# Altium project LM-CAL-TEST.PrjPcb
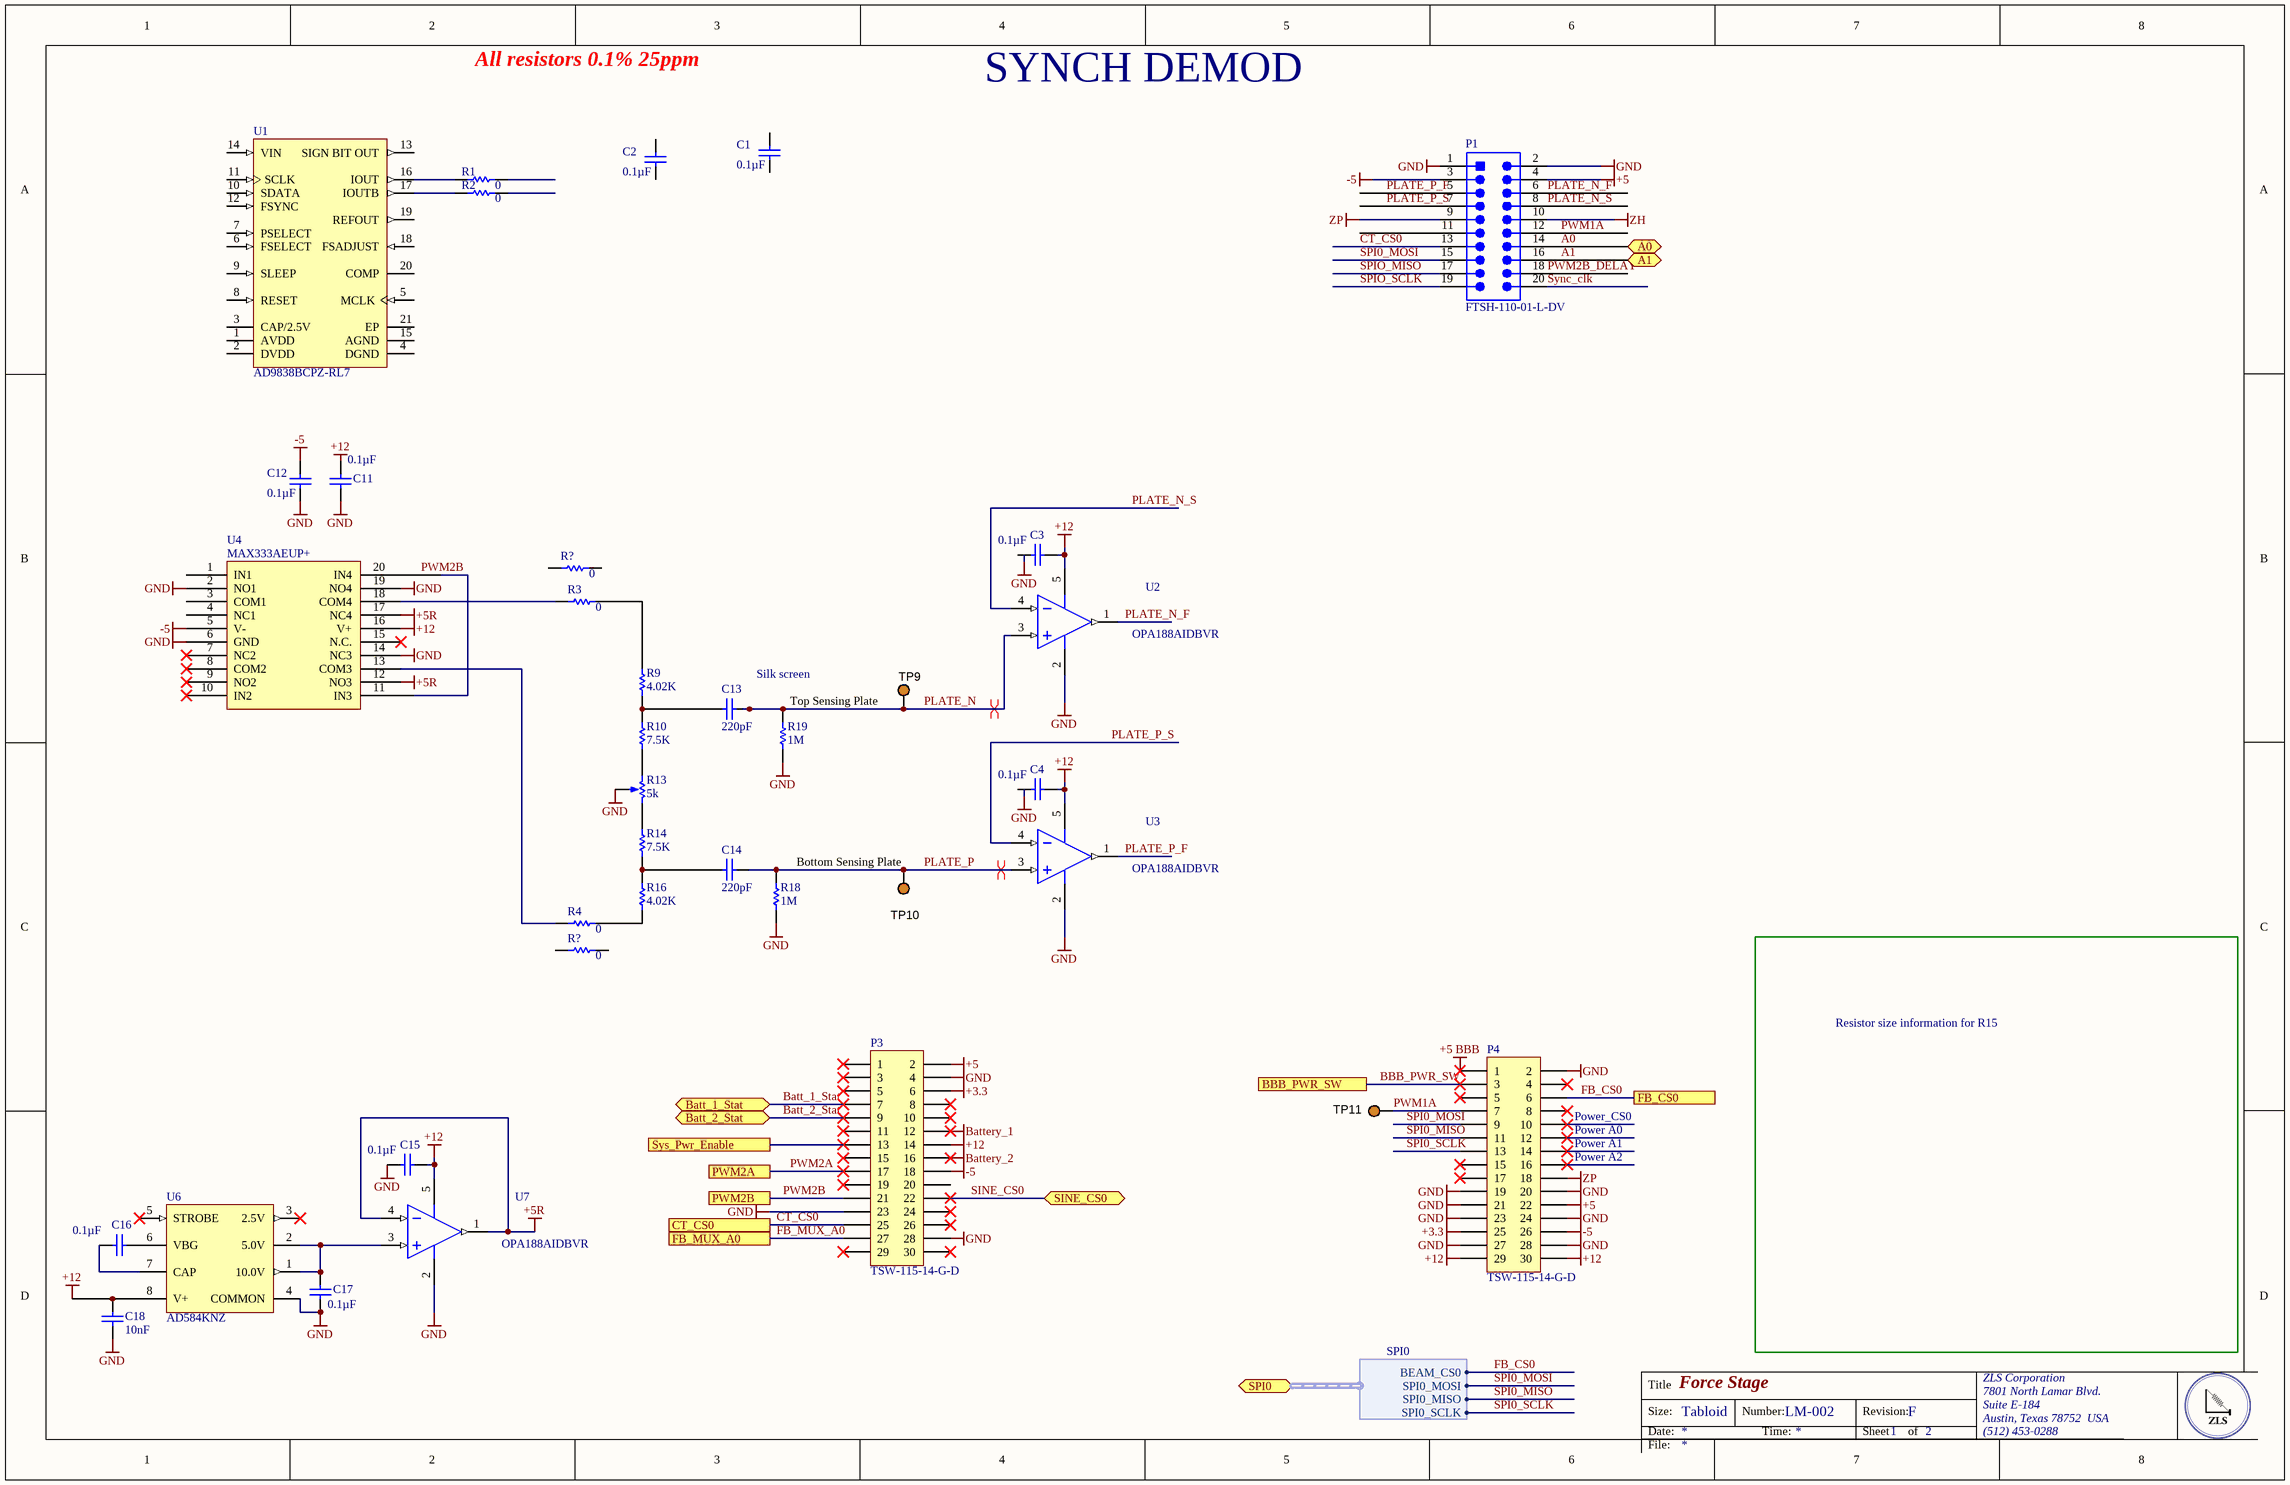
[diagram p0: synch_demod.SchDoc]
6 sheets, 79 parts. Net scope: flat (ports and power ports of the same name join across sheets).
Board file: PCB1.PcbDoc
Sheets:
  synch_demod.SchDoc
  ADC.SchDoc
  BBB.SchDoc
  Beam_Amp.SchDoc
  ZH.SchDoc
  ZP.SchDoc

## Sheet synch_demod.SchDoc: Force Stage
size Tabloid; DocumentNumber: LM-002; Revision: F; SheetNumber: 1; SheetTotal: 2; DocumentName: LM-002; ProjectName: LM-002

### Parts
(Parts that share a designator on the sheet are numbered #1, #2 ... from top to bottom, then left to right.)
C1  Capacitance: 0.1µF  [CAPC0805(2012)145_N]  (hidden comment: CAP CER 0.1UF 25V X7R 0805)
C2  Capacitance: 0.1µF  [CAPC0805(2012)145_N]  (hidden comment: CAP CER 0.1UF 25V X7R 0805)
C3  Capacitance: 0.1µF  [CAPC0805(2012)145_N]  (hidden comment: CAP CER 0.1UF 25V X7R 0805)
C4  Capacitance: 0.1µF  [CAPC0805(2012)145_N]  (hidden comment: CAP CER 0.1UF 25V X7R 0805)
C11  Capacitance: 0.1µF  [CAPC0805(2012)145_N]  (hidden comment: CAP CER 0.1UF 25V X7R 0805)
C12  Capacitance: 0.1µF  [CAPC0805(2012)145_N]  (hidden comment: CAP CER 0.1UF 25V X7R 0805)
C13  Capacitance: 220pF  [CAPC0805(2012)155_L]  (hidden comment: CAP CER 1UF 25V X7R 0805)
C14  Capacitance: 220pF  [CAPC0805(2012)155_L]  (hidden comment: CAP CER 1UF 25V X7R 0805)
C15  Capacitance: 0.1µF  [CAPC0805(2012)145_N]  (hidden comment: CAP CER 0.1UF 25V X7R 0805)
C16  Capacitance: 0.1µF  [CAPC0805(2012)145_N]  (hidden comment: CAP CER 0.1UF 25V X7R 0805)
C17  Capacitance: 0.1µF  [CAPC0805(2012)145_N]  (hidden comment: CAP CER 0.1UF 25V X7R 0805)
C18  Capacitance: 10nF  [CAPC0805(2012)145_N]  (hidden comment: Multilayer Ceramic Capacitors MLCC - SMD/SMT 0.01uF 50volts 10% X7R)
P1  FTSH-110-01-L-DV  [SMTC-FTSH-110-01-L-DV_V]
P3  TSW-115-14-G-D  [TSW-115-14-G-D]
P4  TSW-115-14-G-D  [TSW-115-14-G-D]
R1  0  [RESC0805(2012)_L]
R2  0  [RESC0805(2012)_L]
R3  0  [RESC0805(2012)_L]
R4  0  [RESC0805(2012)_L]
R9  4.02K  [RESC0805(2012)_L]
R10  7.5K  [RESC0805(2012)_L]
R13  Resistance (Ohms): 5k  [Trimmer 2.54]  (hidden comment: TRIMMER 5K OHM 0.25W PC PIN)
R14  7.5K  [RESC0805(2012)_L]
R16  4.02K  [RESC0805(2012)_L]
R18  1M  [RESC0805(2012)_L]
R19  1M  [RESC0805(2012)_L]
R?#1  0  [RESC0805(2012)_L]
R?#2  0  [RESC0805(2012)_L]
TP9  5003  [KSTN-5003]  (value not drawn)
TP10  5003  [KSTN-5003]  (value not drawn)
TP11  5003  [KSTN-5003]  (value not drawn)
U1  AD9838BCPZ-RL7  [ADI-CP-20-10_M]
U2  OPA188AIDBVR  [DBV0005A_M]
U3  OPA188AIDBVR  [DBV0005A_M]
U4  MAX333AEUP+  [TSOP65P640X90-20N]
U6  AD584KNZ  [ADI-N-8]
U7  OPA188AIDBVR  [DBV0005A_M]

### Ports
A0, A1, Batt_1_Stat, Batt_2_Stat, BBB_PWR_SW, CT_CS0, FB_CS0, FB_MUX_A0, PWM2A, PWM2B, SINE_CS0, SPI0 (harness SPI0), Sys_Pwr_Enable

### Harnesses
SPI0: BEAM_CS0, SPI0_MOSI, SPI0_MISO, SPI0_SCLK

### Nets
+3.3: P3.6 P4.25
+5: P1.4 P3.2 P4.22
+5 BBB: P4.1
+5R: U4.12(NO3) U4.17(NC4) U7.1(OUT) U7.4(IN-)
+12: C3.2 C4.2 C15.2 C18.1 P3.14 P4.29 P4.30 U2.5(V+) U3.5(V+) U4.16(V+) U6.8(V+) U7.5(V+)
-5: C12.1 P1.3 P3.18 P4.26 U4.5(V-)
Battery_1: P3.12
Battery_2: P3.16
GND: C11.2 C12.2 C15.1 C17.2 C18.2 P1.1 P1.2 P3.4 P3.23 P3.28 P4.2 P4.19 P4.20 P4.21 P4.23 P4.24 P4.27 P4.28 R13.2(b) R18.1 R19.1 U2.2(V-) U3.2(V-) U4.2(NO1) U4.6(GND) U4.14(NC3) U4.19(NO4) U6.4(COMMON) U7.2(V-)
ZH: P1.10
ZP: P1.9 P4.18
A0: P1.14 ; port A0
A1: P1.16 ; port A1
Batt_1_Stat: P3.7 ; port Batt_1_Stat
Batt_2_Stat: P3.9 ; port Batt_2_Stat
BBB_PWR_SW: P4.3 ; port BBB_PWR_SW
CT_CS0: P1.13 P3.25 ; port CT_CS0
FB_CS0: P4.6 ; port FB_CS0, port SPI0.BEAM_CS0
FB_MUX_A0: P3.27 ; port FB_MUX_A0
PLATE_N: C13.1 R19.2 TP9.1 U2.3(IN+)
PLATE_N_F: P1.6 U2.1(OUT)
PLATE_N_S: P1.8 U2.4(IN-)
PLATE_P: C14.2 R18.2 TP10.1 U3.3(IN+)
PLATE_P_F: P1.5 U3.1(OUT)
PLATE_P_S: P1.7 U3.4(IN-)
PWM1A: P1.12 P4.7 TP11.1
PWM2A: P3.17 ; port PWM2A
PWM2B: P3.21 U4.11(IN3) U4.20(IN4) ; port PWM2B
PWM2B_DELAY: P1.18
SINE_CS0: P3.22 ; port SINE_CS0
SPI0_MISO: P4.11 ; port SPI0.SPI0_MISO
SPI0_MOSI: P1.15 P4.9 ; port SPI0.SPI0_MOSI
SPI0_SCLK: P4.13 ; port SPI0.SPI0_SCLK
SPIO_MISO: P1.17
SPIO_SCLK: P1.19
Sync_clk: P1.20
NetC13_2: C13.2 R9.1 R10.2
NetC14_1: C14.1 R14.1 R16.2
NetC16_1: C16.1 U6.7(CAP)
NetC16_2: C16.2 U6.6(VBG)
NetC17_1: C17.1 U6.1(10.0V) U6.2(5.0V) U7.3(IN+)
NetP3_13: P3.13 ; port Sys_Pwr_Enable
NetR1_2: R1.2 U1.16(IOUT)
NetR2_2: R2.2 U1.17(IOUTB)
NetR3_1: R3.1 R9.2
NetR3_2: R3.2 U4.18(COM4)
NetR4_1: R4.1 R16.1
NetR4_2: R4.2 U4.13(COM3)
NetR10_1: R10.1 R13.1(a)
NetR13_3: R13.3(c) R14.2

Not connected (* = marked no-connect by the designer): C1 1 2; C2 1 2; C3 1; C4 1; C11 1; P1 11; P3 1* 3* 5* 8* 10* 11* 15* 19* 20 24* 26* 29* 30*; P4 4* 5* 8* 10* 12* 14* 15* 16* 17*; R1 1; R2 1; R?#1 1 2; R?#2 1 2; U1 1(AVDD) 2(DVDD) 3(CAP/2.5V) 4(DGND) 5(MCLK) 6(FSELECT) 7(PSELECT) 8(RESET) 9(SLEEP) 10(SDATA) 11(SCLK) 12(FSYNC) 13(SIGN_BIT_OUT) 14(VIN) 15(AGND) 18(FSADJUST) 19(REFOUT) 20(COMP) 21(EP); U4 1(IN1) 3(COM1) 4(NC1) 7(NC2)* 8(COM2)* 9(NO2)* 10(IN2)* 15(N.C.)*; U6 3(2.5V)* 5(STROBE)*

### Layout directives
differential pair: PLATE_N, PLATE_P

### Notes on the sheet
- All resistors 0.1% 25ppm
- SYNCH DEMOD
- Silk screen
- Top Sensing Plate
- (near TP10) Bottom Sensing Plate
- Resistor size information for R15
- (near P4) Power_CS0
- (near P4) Power A0
- (near P4) Power A1
- (near P4) Power A2
- Labels drawn without touching a wire or pin: +12
- Title
- Size:
- Date:
- Tabloid
- Number:
- Time:
- Revision:
- Sheet
- of
- ZLS Corporation
- 7801 North Lamar Blvd.
- Suite E-184
- Austin, Texas 78752  USA
- (512) 453-0288
- File:

### Library data of the parts
C1-C4 C11 C12 C15-C17 = CMP-1036-04795-1: Manufacturer: Murata Electronics North America; Manufacturer Part Number: GRM21BR71E104KA01L; Tolerance: ±10%; Supplier 1: Digi-Key; Supplier Part Number 1: 490-1673-6-ND; RoHS: RoHS Compliant; Category: Capacitors; Stock 1: 891652; Pricing 1: 1=0.2, 10=0.145, 100=0.0683, 500=0.04788, 1000=0.03964 (USD); Packaging: Digi-Reel®; Part Status: Active; Voltage - Rated: 25V; Temperature Coefficient: X7R; Operating Temperature: -55°C ~ 125°C; Features: -; Ratings: -; Applications: General Purpose; Mounting Type: Surface Mount, MLCC; Package / Case: 0805 (2012 Metric); Size / Dimension: 0.079" L x 0.049" W (2.00mm x 1.25mm); Height - Seated (Max): -; Thickness (Max): 0.053" (1.35mm); Lead Spacing: -; Lead Style: -; ComponentLink1URL: http://www.murata.com/~/media/webrenewal/support/library/catalog/products/capacitor/mlcc/c02e.ashx; ComponentLink1Description: http://www.murata.com/~/media/webrenewal/support/library/catalog/products/capacitor/mlcc/c02e.ashx
C13 C14 = CMP-1036-04882-1: Manufacturer: Murata Electronics North America; Manufacturer Part Number: GRM21BR71E105KA99L; Tolerance: ±10%; Supplier 1: Digi-Key; Supplier Part Number 1: 490-6484-6-ND; RoHS: RoHS Compliant; Category: Capacitors; Stock 1: 295074; Pricing 1: 1=0.14, 10=0.099, 100=0.0468, 500=0.0328, 1000=0.02715 (USD); Packaging: Digi-Reel®; Part Status: Active; Voltage - Rated: 25V; Temperature Coefficient: X7R; Operating Temperature: -55°C ~ 125°C; Features: -; Ratings: -; Applications: General Purpose; Mounting Type: Surface Mount, MLCC; Package / Case: 0805 (2012 Metric); Size / Dimension: 0.079" L x 0.049" W (2.00mm x 1.25mm); Height - Seated (Max): -; Thickness (Max): 0.053" (1.35mm); Lead Spacing: -; Lead Style: -; ComponentLink1URL: http://www.murata.com/~/media/webrenewal/support/library/catalog/products/capacitor/mlcc/c02e.ashx; ComponentLink1Description: http://www.murata.com/~/media/webrenewal/support/library/catalog/products/capacitor/mlcc/c02e.ashx
C18 = CMP-1036-04795-1: Manufacturer: Kemet; Manufacturer Part Number: C0805C103K5RACAUTO; Voltage Rating: 50V; Supplier 1: Digi-Key; Supplier Part Number 1: 399-6924-1-ND; Stock 1: 63236; Pricing 1: 1=0.12, 10=0.087, 100=0.041, 500=0.0287, 1000=0.0238 (USD); Mount: Surface Mount; Case/Package: 0805; Case Code (Metric): 2012; Case Code (Imperial): 0805; Dielectric Material: Ceramic; Contact Plating: Tin; Min Operating Temperature: -55°C; Max Operating Temperature: 125°C; Tolerance: 10%; Packaging: Tape and Reel; Package Quantity: 1; Voltage Rating (DC): 50V; Dielectric: X7R; Termination: SMD/SMT; Length: 2mm; Height: 0.78mm; Width: 0.049inch; Thickness: 0.035inch; Depth: 1.25mm; Radiation Hardening: No; REACH SVHC: No SVHC; ComponentLink1URL: https://datasheet.ciiva.com/22700/1693454-22700519.pdf; ComponentLink1Description: https://datasheet.ciiva.com/22700/1693454-22700519.pdf; ComponentLink2URL: https://datasheet.ciiva.com/7842/1693454-7842175.pdf; ComponentLink2Description: https://datasheet.ciiva.com/7842/1693454-7842175.pdf
P1 = CMP-2000-06294-2: Male Header, Pitch 1.27 mm, 2 x 10 Position, Height 6.1 mm, -55 to 125 degC, RoHS, Tube; Manufacturer: Samtec; Online Catalog: FTSHSeries; Number of Positions Loaded: All; Connector Type: Header,Unshrouded; Product Training Modules: Board-to-BoardConnectors; Featured Product: Board-To-BoardInterconnectSystems; Other Names: SAM1161-10; EDA / CAD Models: DownloadfromAcceleratedDesigns; Number of Positions: 20; Catalog Drawings: FTSHSeriesFTSHSeriesSMTSide; Package Reference: FTSH-110-01-L-DV; Family: RectangularConnectors-Headers,MalePins; Mounting Technology: SurfaceMount; Contact Type: MalePin; Manufacturer URL: http://www.samtec.com/; Package URL: http://suddendocs.samtec.com/prints/ftsh-1xx-xx-xxx-dv-xxx-xxx-mkt.pdf; Package Description: Male Header, Pitch 1.27 mm, 2 x 10 Position, Height 6.1 mm; Packaging: Bulk; Termination: Solder; Category: Connectors,Interconnects; Fastening Type: -; Datasheet Version: F-215 , 02/2016; Contact Finish Thickness: 10µin(0.25µm); Number of Rows: 2; Datasheet URL: http://suddendocs.samtec.com/catalog_english/ftsh_smt.pdf; Mounting Type: SurfaceMount; Series: FTSH; Features: -; Contact Finish: Gold; Standard Package: 1; Color: Black
P3 P4 = Header 15X2: Header, 15-Pin, Dual row; Manufacturer: Samtec Inc.; Pitch - Mating: 0.100" (2.54mm); Number of Positions: 30; Number of Positions Loaded: All; Style: Board to Board or Cable; Shrouding: Unshrouded; Contact Length - Mating: 0.320" (8.13mm); Contact Length - Post: 0.110" (2.79mm); Overall Contact Length: 0.530" (13.46mm); Material Flammability Rating: UL94 V-0; Supplier 1: Digi-Key; Supplier Part Number 1: SAM1052-15-ND; Manufacturer Part Number: TSW-115-14-G-D; RoHS: RoHS Compliant; Category: Connectors, Interconnects; Stock 1: 0; Pricing 1: 1=3.69, 10=3.3, 100=2.7176, 500=2.1482, 1000=1.84409, 5000=1.68233, 10000=1.61763 (USD); Packaging: Bulk; Part Status: Active; Connector Type: Header; Contact Type: Male Pin; Number of Rows: 2; Row Spacing - Mating: 0.100" (2.54mm); Mounting Type: Through Hole; Termination: Solder; Fastening Type: Push-Pull; Insulation Height: 0.100" (2.54mm); Contact Shape: Square; Contact Finish - Mating: Gold; Contact Finish Thickness - Mating: 10.0µin (0.25µm); Contact Finish - Post: Gold; Contact Material: Phosphor Bronze; Insulation Material: Polybutylene Terephthalate (PBT); Features: -; Operating Temperature: -55°C ~ 125°C; Ingress Protection: -; Insulation Color: Black; Current Rating: -; Voltage Rating: -; Mated Stacking Heights: -; Contact Finish Thickness - Post: 3.00µin (0.076µm); Applications: -; ComponentLink1URL: http://suddendocs.samtec.com/prints/tsw-xxx-xx-xxx-x-xx-xxx-mkt.pdf; ComponentLink1Description: http://suddendocs.samtec.com/prints/tsw-xxx-xx-xxx-x-xx-xxx-mkt.pdf
R1-R4 R?#1 R?#2 = CMP-1013-00215-1: RES SMD 0 OHM JUMPER 1/8W 0805; Manufacturer: Panasonic Electronic Components; Manufacturer Part Number: ERJ-6GEY0R00V; Power (Watts): 0.125W, 1/8W; Supplier 1: Digi-Key; Supplier Part Number 1: P0.0ACT-ND; RoHS: RoHS Compliant; Category: Resistors; Stock 1: 3414819; Pricing 1: 1=0.1, 10=0.074, 25=0.0532, 50=0.0406, 100=0.03, 250=0.02288, 500=0.0183, 1000=0.01347 (USD); Packaging: Cut Tape (CT); Part Status: Active; Tolerance: Jumper; Composition: Thick Film; Features: Automotive AEC-Q200; Temperature Coefficient: -; Operating Temperature: -55°C ~ 155°C; Package / Case: 0805 (2012 Metric); Supplier Device Package: 0805; Size / Dimension: 0.079" L x 0.049" W (2.00mm x 1.25mm); Height - Seated (Max): 0.028" (0.70mm); Failure Rate: -; ComponentLink1URL: http://industrial.panasonic.com/www-cgi/jvcr13pz.cgi?E+PZ+3+AOA0001+ERJ6GEY0R00V+7+WW; ComponentLink1Description: http://industrial.panasonic.com/www-cgi/jvcr13pz.cgi?E+PZ+3+AOA0001+ERJ6GEY0R00V+7+WW
R9 R16 = CMP-1013-00215-1: RES SMD 4.02K OHM 1% 1/8W 0805; Manufacturer: Vishay Dale; Manufacturer Part Number: CRCW08054K02FKEAHP; Power (Watts): 0.5W, 1/2W; Temperature Coefficient: ±100ppm/°C; Supplier 1: Digi-Key; Supplier Part Number 1: 541-4.02KTCT-ND; RoHS: RoHS Compliant; Category: Resistors; Stock 1: 2935; Pricing 1: 1=0.28, 10=0.233, 100=0.0911, 1000=0.03812, 2500=0.03494 (USD); Packaging: Cut Tape (CT); Part Status: Active; Tolerance: ±1%; Composition: Thick Film; Features: Automotive AEC-Q200, Pulse Withstanding; Operating Temperature: -55°C ~ 155°C; Package / Case: 0805 (2012 Metric); Supplier Device Package: 0805; Size / Dimension: 0.079" L x 0.049" W (2.00mm x 1.25mm); Height - Seated (Max): 0.020" (0.50mm); Failure Rate: -; ComponentLink1URL: http://www.vishay.com/docs/20043/crcwhpe3.pdf; ComponentLink1Description: http://www.vishay.com/docs/20043/crcwhpe3.pdf
R10 R14 = CMP-1013-00215-1: RES SMD 7.5K OHM 1% 1/8W 0805; Manufacturer: Vishay Dale; Manufacturer Part Number: CRCW08057K50FKEA; Power (Watts): 0.125W, 1/8W; Temperature Coefficient: ±100ppm/°C; Supplier 1: Digi-Key; Supplier Part Number 1: 541-7.50KCCT-ND; RoHS: RoHS Compliant; Category: Resistors; Stock 1: 2093; Pricing 1: 1=0.1, 10=0.055, 100=0.0223, 1000=0.01003, 2500=0.0087 (USD); Packaging: Cut Tape (CT); Part Status: Active; Tolerance: ±1%; Composition: Thick Film; Features: Automotive AEC-Q200; Operating Temperature: -55°C ~ 155°C; Package / Case: 0805 (2012 Metric); Supplier Device Package: 0805; Size / Dimension: 0.079" L x 0.049" W (2.00mm x 1.25mm); Height - Seated (Max): 0.020" (0.50mm); Failure Rate: -; ComponentLink1URL: http://www.vishay.com/docs/20035/dcrcwe3.pdf; ComponentLink1Description: http://www.vishay.com/docs/20035/dcrcwe3.pdf
R13 = Trimmer: Manufacturer: Vishay Foil Resistors (Division of Vishay Precision Group); Manufacturer Part Number: Y00535K00000J0L; Power (Watts): 0.25W, 1/4W; Tolerance: ±5%; Temperature Coefficient: ±10ppm/°C; Number of Turns: 21; Adjustment Type: Side Adjustment; Resistive Material: Metal Foil; Supplier 1: Digi-Key; Supplier Part Number 1: 804-1020-ND; RoHS: RoHS Compliant; Category: Potentiometers, Variable Resistors; Stock 1: 679; Pricing 1: 1=34.42, 10=32.265, 25=26.5292, 50=22.944, 100=22.227, 250=20.793, 500=19.2156 (USD); Packaging: Bulk; Part Status: Active; Mounting Type: Through Hole; Termination Style: PC Pins; Size / Dimension: Rectangular - 0.250" x 0.175" Face x 0.250" L (6.35mm x 4.45mm x 6.35mm); ComponentLink1URL: http://www.vishaypg.com/docs/63053/1240.pdf; ComponentLink1Description: http://www.vishaypg.com/docs/63053/1240.pdf
R18 R19 = CMP-1013-00215-1: RES SMD 1M OHM 1% 1/8W 0805; Manufacturer: Vishay Dale; Manufacturer Part Number: RCV08051M00FKEA; Power (Watts): 0.125W, 1/8W; Temperature Coefficient: ±100ppm/°C; Supplier 1: Digi-Key; Supplier Part Number 1: BC2810CT-ND; RoHS: RoHS Compliant; Category: Resistors; Stock 1: 15942; Pricing 1: 1=0.31, 10=0.266, 100=0.1041, 1000=0.04356, 2500=0.03993 (USD); Packaging: Cut Tape (CT); Part Status: Active; Tolerance: ±1%; Composition: Thick Film; Features: High Voltage; Operating Temperature: -55°C ~ 155°C; Package / Case: 0805 (2012 Metric); Supplier Device Package: 0805; Size / Dimension: 0.079" L x 0.049" W (2.00mm x 1.25mm); Height - Seated (Max): 0.020" (0.50mm); Failure Rate: -; ComponentLink1URL: http://www.vishay.com/docs/20054/rcve3.pdf; ComponentLink1Description: http://www.vishay.com/docs/20054/rcve3.pdf
TP9-TP11 = CMP-1672-00009-1: Test Point, Orange, 1-Pin THD, RoHS; Peak Reverse Current: 600 uA; Forward Current: 3 A; Max Surge Current: 80 A; Forward Voltage: 1.08 V; Max Operating Temperature: 150 degC; PackageReference: 5003; Pins: 2; ComponentLink2URL: http://keyelco.com/userAssets/file/M65p56.pdf; PackageDescription: 1-Pin Through Hole Device, Dia 2.54 mm; Weight: 0.01 lb; Diameter: 5.3 mm; Mount: Through Hole; Package Quantity: 500; Packaging: Bulk; Min Operating Temperature: -65 degC; ComponentLink1Description: Manufacturer URL; Height: 0.25 inch; ComponentLink1URL: http://www.keyelco.com/; ComponentLink2Description: Datasheet; Width: 0.25 inch; REACH SVHC: No SVHC; RoHSCompliant: true; Radiation Hardening: No; Length: 9.5 mm; DatasheetVersion: Jun-15
U1 = CMP-0293-00002-1: 11 mW Power, 2.3 V to 5.5 V,Complete DDS, CP-20-10, 1500 Reel, Pb-Free; Tuning Word Width (bits): 28bit; REFCLK Multiplier: Yes; Master fclk: 16MHz; FS Iout (mA nom): 3mA; I/O Interface: Serial; Resolution (Bits): 10bit; Compliance Range (V): 800mV; ComponentLink1Description: Manufacturer URL; ComponentLink2Description: Datasheet; ComponentLink3URL: http://www.analog.com/static/imported-files/packages/PKG_PDF/LFCSP(CP)/CP_20_10.pdf; PackageVersion: 061609-B; PackageDescription: 20-Lead Lead Frame Chip Scale Package [LFCSP_WQ]; Code_JEDEC: MO-220-WGGD; ComponentLink3Description: Package Specification; DatasheetVersion: Rev. A; PackageReference: CP-20-10; ComponentLink2URL: http://www.analog.com/static/imported-files/data_sheets/AD9838.pdf; ComponentLink1URL: www.analog.com
U2 U3 U7 = CMP-0809-00005-2: Precision, Low Noise, Rail-to-Rail Output, Zero-Drift Operational Amplifier, 4 to 36 V, -40 to 125 degC, 5-pin SOT23 (DBV5), Green (RoHS & no Sb/Br); Manufacturer: Texas Instruments; Total Supply Voltage(Min)(+5V is 5, +/-5V is 10): 4; Offset Drift(Typ)(uV/C): 0.03; Rating: Catalog; SubFamily: Zero Drift Precision Amplifier; GBW(Typ)(MHz): 2; Slew Rate(Typ)(V/us): 0.8; Number of Channels: 1; CMRR(Min)(dB): 120; Iq per channel(Max)(mA): 0.51; Total Supply Voltage(Max)(+5V is 5, +/-5V is 10): 36; PartNumber: OPA188AIDBVR; ComponentLink2Description: Datasheet; ComponentLink2URL: http://www.ti.com/lit/ds/symlink/opa188.pdf; ComponentLink1Description: Manufacturer URL; Mounting Technology: Surface Mount; Eco-Plan: Green (RoHS & no Sb/Br); ComponentLink1URL: http://www.ti.com/; PackageVersion: 4073253-4/K, 03/2006; DatasheetVersion: SBOS642A; ComponentLink3Description: Package Specification; PackageReference: DBV0005A; ComponentLink3URL: http://www.ti.com/litv/pdf/mpds018i; PackageDescription: 5-Pin Plastic Small Outline, Body 1.6 x 2.9 mm, Pitch 0.95 mm; Code_JEDEC: MO-178
U4 = MAX333CWP+: IC SWITCH QUAD SPDT 20TSSOP; Manufacturer: Maxim Integrated; Multiplexer/Demultiplexer Circuit: 2:1; On-State Resistance (Max): 45 Ohm; Channel-to-Channel Matching (&Delta;Ron): 2 Ohm (Max); Voltage - Supply, Single (V+): 10 V ~ 30 V; Voltage - Supply, Dual (V±): ±4.5 V ~ 20 V; Switch Time (Ton, Toff) (Max): 175ns, 145ns; Charge Injection: 2pC; Channel Capacitance (CS(off), CD(off)): 5pF; Current - Leakage (IS(off)) (Max): 250pA; Crosstalk: -78dB @ 1MHz; Supplier 1: Digi-Key; Supplier Part Number 1: MAX333AEUP+-ND; Manufacturer Part Number: MAX333AEUP+; RoHS: RoHS Compliant; Category: Integrated Circuits (ICs); Stock 1: 1328; Pricing 1: 1=6.77, 10=6.432, 25=6, 50=5.8942 (USD); Packaging: Tube; Part Status: Active; Switch Circuit: SPDT; -3db Bandwidth: -; Operating Temperature: -40°C ~ 85°C (TA); Package / Case: 20-TSSOP (0.173", 4.40mm Width); Supplier Device Package: 20-TSSOP; Base Part Number: MAX333; ComponentLink1URL: https://pdfserv.maximintegrated.com/en/ds/MAX333A.pdf; ComponentLink1Description: https://pdfserv.maximintegrated.com/en/ds/MAX333A.pdf
U6 = CMP-0784-00054-1: Pin Programmable, Precision Voltage Reference, + 2.5 / + 5 / + 7.5 / + 10 Prog V Output, 4.5 to 30 V Supply, Commercial, 8-pin DIP (N-8), Tube; Manufacturer: Analog Devices; Max V Supply (V): 30; Min V Supply (V): 4.5; Ref Out TC (ppm/C): 15; Vout: 2.5V, 5V, 7.5V, 10V; ComponentLink3URL: http:/www.analog.com/static/imported-files/packages/PKG_PDF/PDIP(N)/N_8.pdf; ComponentLink1URL: http://www.analog.com/en/index.html; PartNumber: AD584KNZ; ComponentLink1Description: Manufacturer URL; ComponentLink2Description: Datasheet; PackageDescription: 8-Pin Plastic Dual In-Line Package, Row spacing 7.62 mm, Pitch 2.54 mm; Operating Temp Range: 0 to 70 degC; DatasheetVersion: Rev. C; Code_JEDEC: MS-001; Packing: Tube; ComponentLink3Description: Package Specification; PackageReference: N-8; ComponentLink4Description: URL Link1; Mounting Technology: Through Hole; PackageVersion: 070606-A, 07/2006; ComponentLink4URL: Product URL:http://www.analog.com/en/special-linear-functions/voltage-references/ad584/products/product.html; ComponentLink2URL: http://www.analog.com/static/imported-files/data_sheets/AD584.pdf

## Sheet ADC.SchDoc: Sense Stage
size Tabloid; DocumentNumber: LM-002; Revision: F; SheetNumber: 2; SheetTotal: 2; DocumentName: LM-002
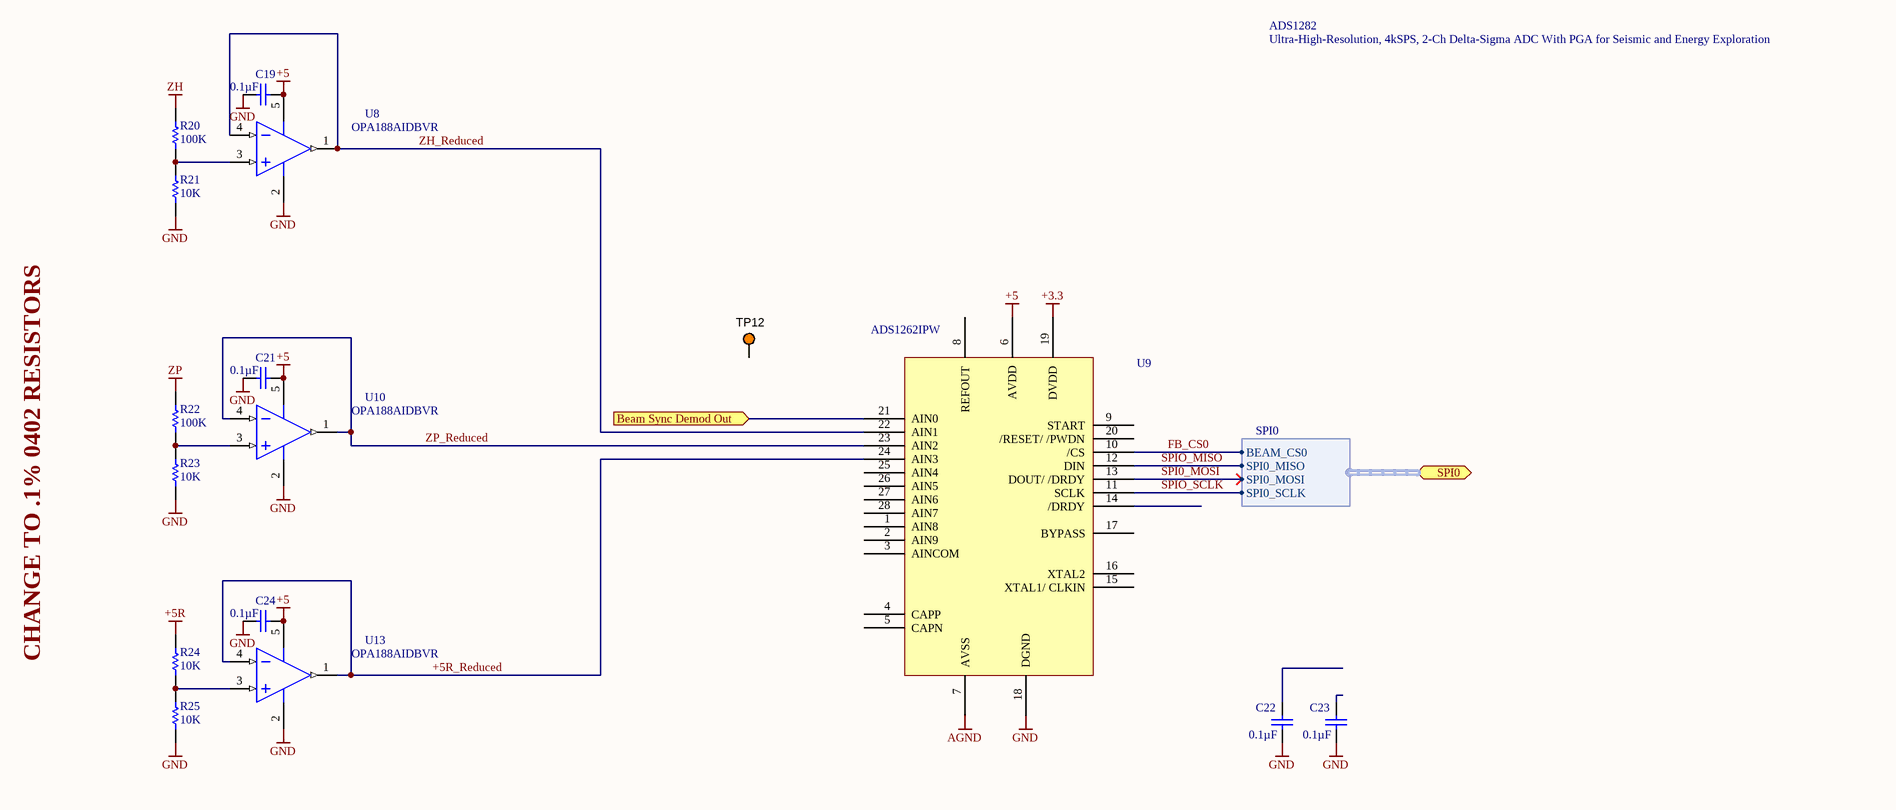
[diagram p1: ADC.SchDoc]

### Parts
C19  Capacitance: 0.1µF  [CAPC0805(2012)145_N]  (hidden comment: CAP CER 0.1UF 25V X7R 0805)
C21  Capacitance: 0.1µF  [CAPC0805(2012)145_N]  (hidden comment: CAP CER 0.1UF 25V X7R 0805)
C22  Capacitance: 0.1µF  [CAPC0805(2012)145_N]  (hidden comment: CAP CER 0.1UF 25V X7R 0805)
C23  Capacitance: 0.1µF  [CAPC0805(2012)145_N]  (hidden comment: CAP CER 0.1UF 25V X7R 0805)
C24  Capacitance: 0.1µF  [CAPC0805(2012)145_N]  (hidden comment: CAP CER 0.1UF 25V X7R 0805)
R20  100K  [RESC0805(2012)_L]
R21  10K  [RESC0805(2012)_L]
R22  100K  [RESC0805(2012)_L]
R23  10K  [RESC0805(2012)_L]
R24  10K  [RESC0805(2012)_L]
R25  10K  [RESC0805(2012)_L]
TP12  5003  [KSTN-5003]  (value not drawn)
U8  OPA188AIDBVR  [DBV0005A_M]
U9  Supplier Part Number 1: ADS1262IPW  [ADS1262]  (hidden comment: ADS1262)
U10  OPA188AIDBVR  [DBV0005A_M]
U13  OPA188AIDBVR  [DBV0005A_M]

### Ports
Beam Sync Demod Out (in), SPI0 (harness SPI0)

### Harnesses
SPI0: BEAM_CS0, SPI0_MOSI, SPI0_MISO, SPI0_SCLK

### Nets
+3.3: U9.19(DVDD)
+5: C19.2 C21.2 C24.2 U8.5(V+) U9.6(AVDD) U10.5(V+) U13.5(V+)
+5R: R24.2
AGND: U9.7(AVSS)
GND: C19.1 C21.1 C22.2 C23.2 C24.1 R21.1 R23.1 R25.1 U8.2(V-) U9.18(DGND) U10.2(V-) U13.2(V-)
ZH: R20.2
ZP: R22.2
+5R_Reduced: U9.24(AIN3) U13.1(OUT) U13.4(IN-)
FB_CS0: U9.10(/CS) ; port SPI0.BEAM_CS0
SPI0_MOSI: U9.13(DOUT/_/DRDY) ; port SPI0.SPI0_MOSI
SPIO_MISO: U9.12(DIN) ; port SPI0.SPI0_MISO  [project net SPI0_MISO]
SPIO_SCLK: U9.11(SCLK) ; port SPI0.SPI0_SCLK  [project net SPI0_SCLK]
ZH_Reduced: U8.1(OUT) U8.4(IN-) U9.22(AIN1)
ZP_Reduced: U9.23(AIN2) U10.1(OUT) U10.4(IN-)
NetR20_1: R20.1 R21.2 U8.3(IN+)
NetR22_1: R22.1 R23.2 U10.3(IN+)
NetR24_1: R24.1 R25.2 U13.3(IN+)
NetU9_21: U9.21(AIN0) ; port Beam Sync Demod Out

Not connected (* = marked no-connect by the designer): C22 1; C23 1; TP12 1; U9 1(AIN8) 2(AIN9) 3(AINCOM) 4(CAPP) 5(CAPN) 8(REFOUT) 9(START) 14(/DRDY) 15(XTAL1/_CLKIN) 16(XTAL2) 17(BYPASS) 20(/RESET/_/PWDN) 25(AIN4) 26(AIN5) 27(AIN6) 28(AIN7)

### Notes on the sheet
- ADS1282
- Ultra-High-Resolution, 4kSPS, 2-Ch Delta-Sigma ADC With PGA for Seismic and Energy Exploration
- CHANGE TO .1% 0402 RESISTORS
- Title
- Size:
- Date:
- Tabloid
- Number:
- Time:
- Revision:
- Sheet
- of
- ZLS Corporation
- 7801 North Lamar Blvd.
- Suite E-184
- Austin, Texas 78752  USA
- (512) 453-0288
- File:

### Library data of the parts
C19 C21-C24 = CMP-1036-04795-1: as C1 on sheet synch_demod; Supplier 1: Digi-Key; Supplier Part Number 1: 490-1673-6-ND; RoHS: RoHS Compliant; Category: Capacitors; Stock 1: 891652; Pricing 1: 1=0.2, 10=0.145, 100=0.0683, 500=0.04788, 1000=0.03964 (USD); Packaging: Digi-Reel®; Part Status: Active; Voltage - Rated: 25V; Temperature Coefficient: X7R; Operating Temperature: -55°C ~ 125°C; Features: -; Ratings: -; Applications: General Purpose; Mounting Type: Surface Mount, MLCC; Package / Case: 0805 (2012 Metric); Size / Dimension: 0.079" L x 0.049" W (2.00mm x 1.25mm); Height - Seated (Max): -; Thickness (Max): 0.053" (1.35mm); Lead Spacing: -; Lead Style: -; ComponentLink1URL: http://www.murata.com/~/media/webrenewal/support/library/catalog/products/capacitor/mlcc/c02e.ashx; ComponentLink1Description: http://www.murata.com/~/media/webrenewal/support/library/catalog/products/capacitor/mlcc/c02e.ashx
R20 R22 = CMP-1013-00215-1: RES SMD 100K OHM 1% 1/8W 0805; Manufacturer: Vishay Dale; Manufacturer Part Number: RCA0805100KFKEA; Power (Watts): 0.125W, 1/8W; Temperature Coefficient: ±100ppm/°C; Supplier 1: Digi-Key; Supplier Part Number 1: 541-2230-1-ND; RoHS: RoHS Compliant; Category: Resistors; Stock 1: 18704; Pricing 1: 1=0.1, 10=0.079, 100=0.0303, 1000=0.01331, 2500=0.0115 (USD); Packaging: Cut Tape (CT); Part Status: Active; Tolerance: ±1%; Composition: Thick Film; Features: Anti-Sulfur, Automotive AEC-Q200; Operating Temperature: -55°C ~ 155°C; Package / Case: 0805 (2012 Metric); Supplier Device Package: 0805; Size / Dimension: 0.079" L x 0.049" W (2.01mm x 1.25mm); Height - Seated (Max): 0.020" (0.50mm); Failure Rate: -; ComponentLink1URL: http://www.vishay.com/docs/20037/rcae3.pdf; ComponentLink1Description: http://www.vishay.com/docs/20037/rcae3.pdf
R21 R23-R25 = CMP-1013-00215-1: RES SMD 10K OHM 1% 1/8W 0805; Manufacturer: Vishay Dale; Manufacturer Part Number: CRCW080510K0FKEA; Power (Watts): 0.125W, 1/8W; Temperature Coefficient: ±100ppm/°C; Supplier 1: Digi-Key; Supplier Part Number 1: 541-10.0KCCT-ND; RoHS: RoHS Compliant; Category: Resistors; Stock 1: 1104982; Pricing 1: 1=0.1, 10=0.055, 100=0.0223, 1000=0.01003, 2500=0.0087 (USD); Packaging: Cut Tape (CT); Part Status: Active; Tolerance: ±1%; Composition: Thick Film; Features: Automotive AEC-Q200; Operating Temperature: -55°C ~ 155°C; Package / Case: 0805 (2012 Metric); Supplier Device Package: 0805; Size / Dimension: 0.079" L x 0.049" W (2.00mm x 1.25mm); Height - Seated (Max): 0.020" (0.50mm); Failure Rate: -; ComponentLink1URL: http://www.vishay.com/docs/20035/dcrcwe3.pdf; ComponentLink1Description: http://www.vishay.com/docs/20035/dcrcwe3.pdf
TP12 = CMP-1672-00009-1: as TP9 on sheet synch_demod; Max Operating Temperature: 150 degC; PackageReference: 5003; Pins: 2; ComponentLink2URL: http://keyelco.com/userAssets/file/M65p56.pdf; PackageDescription: 1-Pin Through Hole Device, Dia 2.54 mm; Weight: 0.01 lb; Diameter: 5.3 mm; Mount: Through Hole; Package Quantity: 500; Packaging: Bulk; Min Operating Temperature: -65 degC; ComponentLink1Description: Manufacturer URL; Height: 0.25 inch; ComponentLink1URL: http://www.keyelco.com/; ComponentLink2Description: Datasheet; Width: 0.25 inch; REACH SVHC: No SVHC; RoHSCompliant: true; Radiation Hardening: No; Length: 9.5 mm; DatasheetVersion: Jun-15
U8 U10 U13 = CMP-0809-00005-2: as U2 on sheet synch_demod; PartNumber: OPA188AIDBVR; ComponentLink2Description: Datasheet; ComponentLink2URL: http://www.ti.com/lit/ds/symlink/opa188.pdf; ComponentLink1Description: Manufacturer URL; Mounting Technology: Surface Mount; Eco-Plan: Green (RoHS & no Sb/Br); ComponentLink1URL: http://www.ti.com/; PackageVersion: 4073253-4/K, 03/2006; DatasheetVersion: SBOS642A; ComponentLink3Description: Package Specification; PackageReference: DBV0005A; ComponentLink3URL: http://www.ti.com/litv/pdf/mpds018i; PackageDescription: 5-Pin Plastic Small Outline, Body 1.6 x 2.9 mm, Pitch 0.95 mm; Code_JEDEC: MO-178
U9 = ADS1262: 32 bit Analog to Digital Converter; Manufacturer: Texas Instruments; Sampling Rate: 38400S/s; Interface: SPI; Number of A/D Converters: 1; Resolution: 32b; Number of Bits: 32; Min Supply Voltage: 4.75V; Max Supply Voltage: 5.25V; Power Consumption: 27mW; Supply Type: Single; Polarity: Bipolar,Unipolar; Operating Supply Voltage: 5V; Number of Inputs: 10; Supplier 1: Arrow; Manufacturer Part Number: ADS1262IPW; Stock 1: 86; Pricing 1: 1=18.662, 10=17.123, 100=14.538, 500=12.925 (USD); Mount: Surface Mount; Case/Package: TSSOP; Number of Pins: 28; Contact Plating: Gold; Min Operating Temperature: -40°C; Max Operating Temperature: 125°C; Packaging: Rail/Tube; REACH SVHC: No SVHC; Lead Free: Lead Free

## Sheet BBB.SchDoc
size Tabloid
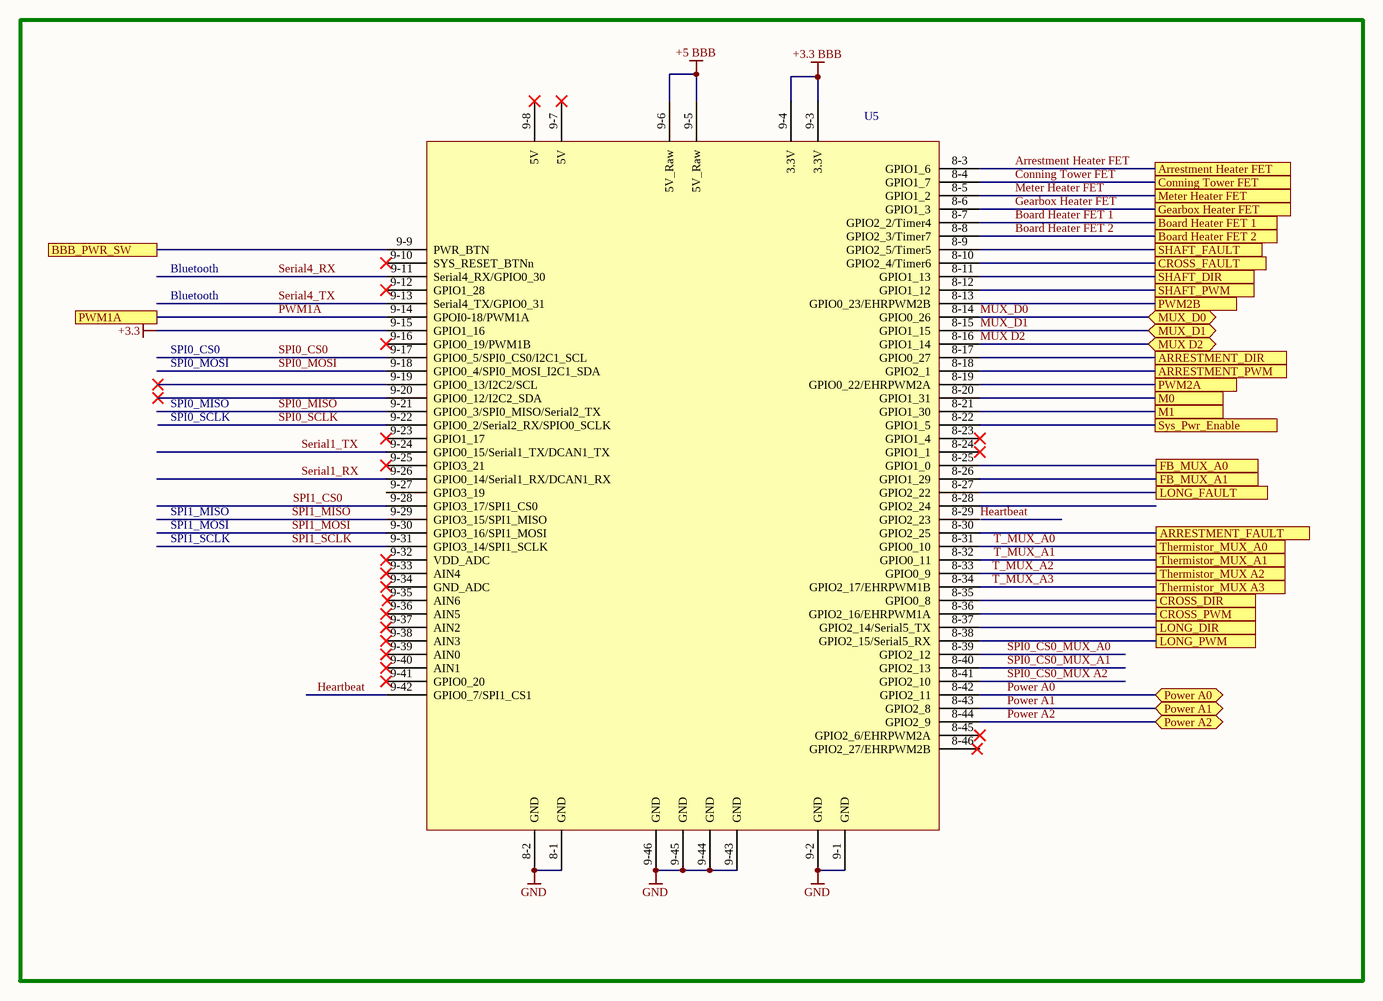
[diagram p2: BBB.SchDoc]

### Parts
U5  BBB Header x 2  [Beaglebone Black Thru]  (value not drawn)

### Ports
Arrestment Heater FET, ARRESTMENT_DIR, ARRESTMENT_FAULT, ARRESTMENT_PWM, BBB_PWR_SW, Board Heater FET 1, Board Heater FET 2, Conning Tower FET, CROSS_DIR, CROSS_FAULT, CROSS_PWM, FB_MUX_A0, FB_MUX_A1, Gearbox Heater FET, LONG_DIR, LONG_FAULT, LONG_PWM, M0, M1, Meter Heater FET, MUX D2, MUX_D0, MUX_D1, Power A0, Power A1, Power A2, PWM1A, PWM2A, PWM2B, SHAFT_DIR, SHAFT_FAULT, SHAFT_PWM, Sys_Pwr_Enable, Thermistor_MUX A2, Thermistor_MUX A3, Thermistor_MUX_A0, Thermistor_MUX_A1

### Nets
+3.3: U5.9-15(GPIO1_16)
+3.3 BBB: U5.9-3(3.3V) U5.9-4(3.3V)
+5 BBB: U5.9-5(5V_Raw) U5.9-6(5V_Raw)
GND: U5.8-1(GND) U5.8-2(GND) U5.9-1(GND) U5.9-2(GND) U5.9-43(GND) U5.9-44(GND) U5.9-45(GND) U5.9-46(GND)
Arrestment Heater FET: U5.8-3(GPIO1_6) ; port Arrestment Heater FET
BBB_PWR_SW: U5.9-9(PWR_BTN) ; port BBB_PWR_SW
Board Heater FET 1: U5.8-7(GPIO2_2/Timer4) ; port Board Heater FET 1
Board Heater FET 2: U5.8-8(GPIO2_3/Timer7) ; port Board Heater FET 2
Conning Tower FET: U5.8-4(GPIO1_7) ; port Conning Tower FET
FB_MUX_A0: U5.8-25(GPIO1_0) ; port FB_MUX_A0
Gearbox Heater FET: U5.8-6(GPIO1_3) ; port Gearbox Heater FET
Heartbeat: U5.8-29(GPIO2_23) U5.9-42(GPIO0_7/SPI1_CS1)
Meter Heater FET: U5.8-5(GPIO1_2) ; port Meter Heater FET
MUX D2: U5.8-16(GPIO1_14) ; port MUX D2
MUX_D0: U5.8-14(GPIO0_26) ; port MUX_D0
MUX_D1: U5.8-15(GPIO1_15) ; port MUX_D1
Power A0: U5.8-42(GPIO2_11) ; port Power A0
Power A1: U5.8-43(GPIO2_8) ; port Power A1
Power A2: U5.8-44(GPIO2_9) ; port Power A2
PWM1A: U5.9-14(GPOI0-18/PWM1A) ; port PWM1A
PWM2A: U5.8-19(GPIO0_22/EHRPWM2A) ; port PWM2A
PWM2B: U5.8-13(GPIO0_23/EHRPWM2B) ; port PWM2B
Serial1_RX: U5.9-26(GPIO0_14/Serial1_RX/DCAN1_RX)
Serial1_TX: U5.9-24(GPIO0_15/Serial1_TX/DCAN1_TX)
Serial4_RX: U5.9-11(Serial4_RX/GPIO0_30)
Serial4_TX: U5.9-13(Serial4_TX/GPIO0_31)
SPI0_CS0: U5.9-17(GPIO0_5/SPI0_CS0/I2C1_SCL)
SPI0_CS0_MUX A2: U5.8-41(GPIO2_10)
SPI0_CS0_MUX_A0: U5.8-39(GPIO2_12)
SPI0_CS0_MUX_A1: U5.8-40(GPIO2_13)
SPI0_MISO: U5.9-21(GPIO0_3/SPI0_MISO/Serial2_TX)
SPI0_MOSI: U5.9-18(GPIO0_4/SPI0_MOSI_I2C1_SDA)
SPI0_SCLK: U5.9-22(GPIO0_2/Serial2_RX/SPIO0_SCLK)
SPI1_CS0: U5.9-28(GPIO3_17/SPI1_CS0)
SPI1_MISO: U5.9-29(GPIO3_15/SPI1_MISO)
SPI1_MOSI: U5.9-30(GPIO3_16/SPI1_MOSI)
SPI1_SCLK: U5.9-31(GPIO3_14/SPI1_SCLK)
T_MUX_A0: U5.8-31(GPIO0_10) ; port Thermistor_MUX_A0
T_MUX_A1: U5.8-32(GPIO0_11) ; port Thermistor_MUX_A1
T_MUX_A2: U5.8-33(GPIO0_9) ; port Thermistor_MUX A2
T_MUX_A3: U5.8-34(GPIO2_17/EHRPWM1B) ; port Thermistor_MUX A3
NetP3_13: U5.8-22(GPIO1_5) ; port Sys_Pwr_Enable
NetU5_8-9: U5.8-9(GPIO2_5/Timer5) ; port SHAFT_FAULT
NetU5_8-10: U5.8-10(GPIO2_4/Timer6) ; port CROSS_FAULT
NetU5_8-11: U5.8-11(GPIO1_13) ; port SHAFT_DIR
NetU5_8-12: U5.8-12(GPIO1_12) ; port SHAFT_PWM
NetU5_8-17: U5.8-17(GPIO0_27) ; port ARRESTMENT_DIR
NetU5_8-18: U5.8-18(GPIO2_1) ; port ARRESTMENT_PWM
NetU5_8-20: U5.8-20(GPIO1_31) ; port M0
NetU5_8-21: U5.8-21(GPIO1_30) ; port M1
NetU5_8-26: U5.8-26(GPIO1_29) ; port FB_MUX_A1
NetU5_8-27: U5.8-27(GPIO2_22) ; port LONG_FAULT
NetU5_8-30: U5.8-30(GPIO2_25) ; port ARRESTMENT_FAULT
NetU5_8-35: U5.8-35(GPIO0_8) ; port CROSS_DIR
NetU5_8-36: U5.8-36(GPIO2_16/EHRPWM1A) ; port CROSS_PWM
NetU5_8-37: U5.8-37(GPIO2_14/Serial5_TX) ; port LONG_DIR
NetU5_8-38: U5.8-38(GPIO2_15/Serial5_RX) ; port LONG_PWM

Not connected (* = marked no-connect by the designer): U5 8-23(GPIO1_4)* 8-24(GPIO1_1)* 8-28(GPIO2_24) 8-45(GPIO2_6/EHRPWM2A)* 8-46(GPIO2_27/EHRPWM2B) 9-7(5V)* 9-8(5V)* 9-10(SYS_RESET_BTNn)* 9-12(GPIO1_28)* 9-16(GPIO0_19/PWM1B)* 9-19(GPIO0_13/I2C2/SCL)* 9-20(GPIO0_12/I2C2_SDA)* 9-23(GPIO1_17)* 9-25(GPIO3_21)* 9-27(GPIO3_19) 9-32(VDD_ADC)* 9-33(AIN4)* 9-34(GND_ADC)* 9-35(AIN6) 9-36(AIN5)* 9-37(AIN2)* 9-38(AIN3)* 9-39(AIN0)* 9-40(AIN1)* 9-41(GPIO0_20)*

### Notes on the sheet
- Bluetooth
- SPI0_CS0
- SPI0_MOSI
- SPI0_MISO
- SPI0_SCLK
- SPI1_MISO
- SPI1_MOSI
- SPI1_SCLK
- Title
- Size:
- Date:
- Tabloid
- Number:
- Time:
- Revision:
- Sheet
- of
- ZLS Corporation
- 7801 North Lamar Blvd.
- Suite E-184
- Austin, Texas 78752  USA
- (512) 453-0288
- File:

### Library data of the parts
U5 = Beaglebone_Black: Beaglebone Black Header; Manufacturer: Samtec Inc.; Manufacturer Part Number: SSW-123-03-G-D; Connector Type: Receptacle; Style: Board to Board or Cable; Number of Positions: 46; Number of Positions Loaded: All; Pitch - Mating: 0.100" (2.54mm); Contact Length - Post: 0.394" (10.00mm); Material Flammability Rating: UL94 V-0; Current Rating: 5.7A per Contact; Supplier 1: Digi-Key; Supplier Part Number 1: SSW-123-03-G-D-ND; RoHS: RoHS Compliant; Category: Connectors, Interconnects; Stock 1: 0; Pricing 1: 1=6.51 (USD); Packaging: Bulk; Part Status: Active; Contact Type: Forked; Row Spacing - Mating: 0.100" (2.54mm); Mounting Type: Through Hole; Termination: Solder; Fastening Type: Push-Pull; Contact Finish - Mating: Gold; Contact Finish Thickness - Mating: 20.0µin (0.51µm); Insulation Color: Black; Insulation Height: 0.335" (8.51mm); Operating Temperature: -55°C ~ 125°C; Contact Finish - Post: Gold; Mated Stacking Heights: -; Ingress Protection: -; Features: -; Voltage Rating: -; Applications: -; Insulation Material: Liquid Crystal Polymer (LCP); Contact Shape: Square; Contact Material: Phosphor Bronze; Contact Finish Thickness - Post: 3.00µin (0.076µm)

## Sheet Beam_Amp.SchDoc
size Tabloid
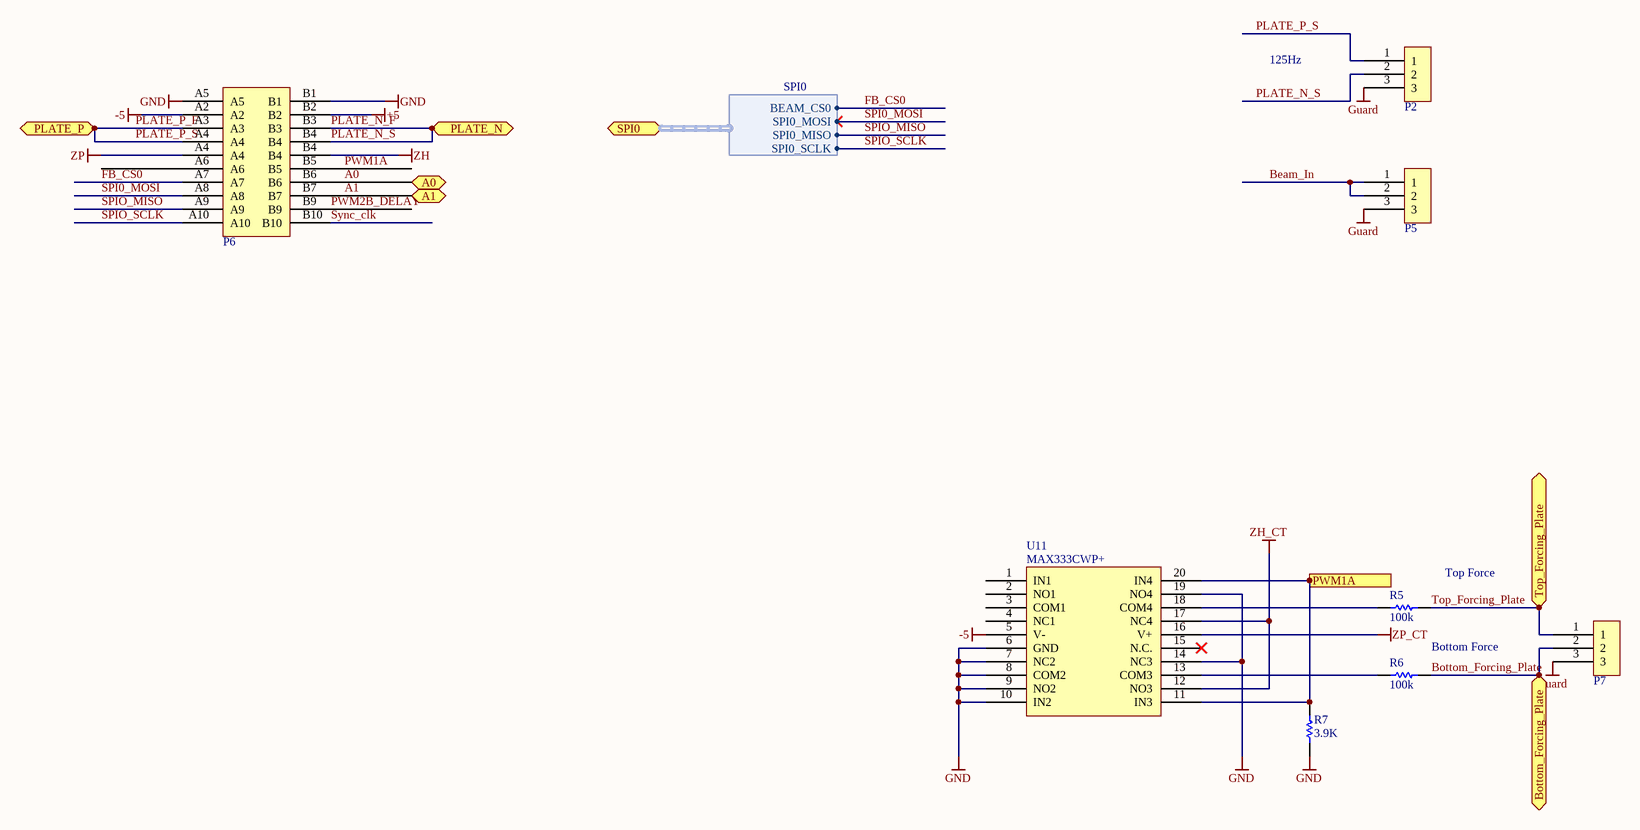
[diagram p3: Beam_Amp.SchDoc]

### Parts
P2  Triax_Conn  [Triax_Conn]  (value not drawn)
P5  Triax_Conn  [Triax_Conn]  (value not drawn)
P6  MEC6-110-0-PCB  [MEC6-110-02-L-DV]  (value not drawn)
P7  Triax_Conn  [Triax_Conn]  (value not drawn)
R5  100k  [RESC0402(1005)_M]
R6  100k  [RESC0402(1005)_M]
R7  3.9K  [RESC0402(1005)_M]
U11  MAX333CWP+  [TSOP65P640X90-20N]

### Ports
A0, A1, Bottom_Forcing_Plate, PLATE_N, PLATE_P, PWM1A, SPI0 (harness SPI0), Top_Forcing_Plate

### Harnesses
SPI0: BEAM_CS0, SPI0_MOSI, SPI0_MISO, SPI0_SCLK

### Nets
+5: P6.B2
-5: P6.A2 U11.5(V-)
GND: P6.A5 P6.B1 R7.1 U11.6(GND) U11.7(NC2) U11.8(COM2) U11.9(NO2) U11.10(IN2) U11.14(NC3) U11.19(NO4)
Guard: P2.3 P5.3 P7.3
ZH: P6.B4
ZH_CT: U11.12(NO3) U11.17(NC4)
ZP: P6.A4
ZP_CT: U11.16(V+)
A0: P6.B6 ; port A0
A1: P6.B7 ; port A1
Beam_In: P5.1 P5.2
Bottom_Forcing_Plate: P7.2 R6.1 ; port Bottom_Forcing_Plate
FB_CS0: P6.A7 ; port SPI0.BEAM_CS0
PLATE_N_F: P2.2 P6.B3 P6.B4 ; port PLATE_N  [also labelled PLATE_N_S]
PLATE_P_F: P2.1 P6.A3 P6.A4 ; port PLATE_P  [also labelled PLATE_P_S]
PWM1A: R7.2 U11.11(IN3) U11.20(IN4) ; port PWM1A
PWM1A: P6.B5  [a separate net that carries the same name]
PWM2B_DELAY: P6.B9
SPI0_MOSI: P6.A8 ; port SPI0.SPI0_MOSI
SPIO_MISO: P6.A9 ; port SPI0.SPI0_MISO  [project net SPI0_MISO]
SPIO_SCLK: P6.A10 ; port SPI0.SPI0_SCLK  [project net SPI0_SCLK]
Sync_clk: P6.B10
Top_Forcing_Plate: P7.1 R5.1 ; port Top_Forcing_Plate
NetR5_2: R5.2 U11.18(COM4)
NetR6_2: R6.2 U11.13(COM3)

Not connected (* = marked no-connect by the designer): P6 A6; U11 1(IN1) 2(NO1) 3(COM1) 4(NC1) 15(N.C.)*

### Notes on the sheet
- 125Hz
- (near R5) Top Force
- Bottom Force
- Title
- Size:
- Date:
- Tabloid
- Number:
- Time:
- Revision:
- Sheet
- of
- ZLS Corporation
- 7801 North Lamar Blvd.
- Suite E-184
- Austin, Texas 78752  USA
- (512) 453-0288
- File:

### Library data of the parts
R5 R6 = CMP-1011-00651-1
R7 = CMP-1011-00463-1
U11 = MAX333CWP+: IC SWITCH QUAD SPDT 20TSSOP; Manufacturer: Maxim; Manufacturer Part Number: MAX333AEUP+; Max Supply Voltage: 30V; Min Supply Voltage: 10V; Min Dual Supply Voltage: 4.5V; Max Dual Supply Voltage: 20V; On-State Resistance: 35R; Operating Supply Current: 1uA; Supply Type: Single,Dual; Max Power Dissipation: 559mW; Turn-On Delay Time: 175ns; Turn-Off Delay Time: 145ns; Max Supply Current: 250uA; Number of Bits: 4; Dual Supply Voltage: 15V; Supplier 1: Mouser; Supplier Part Number 1: 700-MAX333AEUP; Stock 1: 664; Pricing 1: 1=6.77, 10=6.43, 50=5.8, 100=5.8, 1000=5.62, 10000=5.62 (USD); Case/Package: TSSOP; Number of Pins: 20; Weight: 0.006737oz; Min Operating Temperature: -40°C; Max Operating Temperature: 85°C; Packaging: Rail/Tube; Package Quantity: 74; Throw Configuration: SPDT; Number of Channels: 4; Length: 6.6mm; Height: 0.95mm; Width: 4.5mm; Radiation Hardening: No; Lead Free: Lead Free; REACH SVHC: Unknown; ComponentLink1URL: https://datasheet.ciiva.com/2978/max333a-2978850.pdf; ComponentLink1Description: https://datasheet.ciiva.com/2978/max333a-2978850.pdf; ComponentLink2URL: https://datasheet.ciiva.com/30478/0900766b81253c85-30478260.pdf; ComponentLink2Description: https://datasheet.ciiva.com/30478/0900766b81253c85-30478260.pdf; ComponentLink3URL: https://datasheet.ciiva.com/1674/max333a-1674617.pdf; ComponentLink3Description: https://datasheet.ciiva.com/1674/max333a-1674617.pdf; ComponentLink4URL: https://datasheet.ciiva.com/26825/max333aeup-26825546.pdf; ComponentLink4Description: https://datasheet.ciiva.com/26825/max333aeup-26825546.pdf

## Sheet ZH.SchDoc
size Tabloid
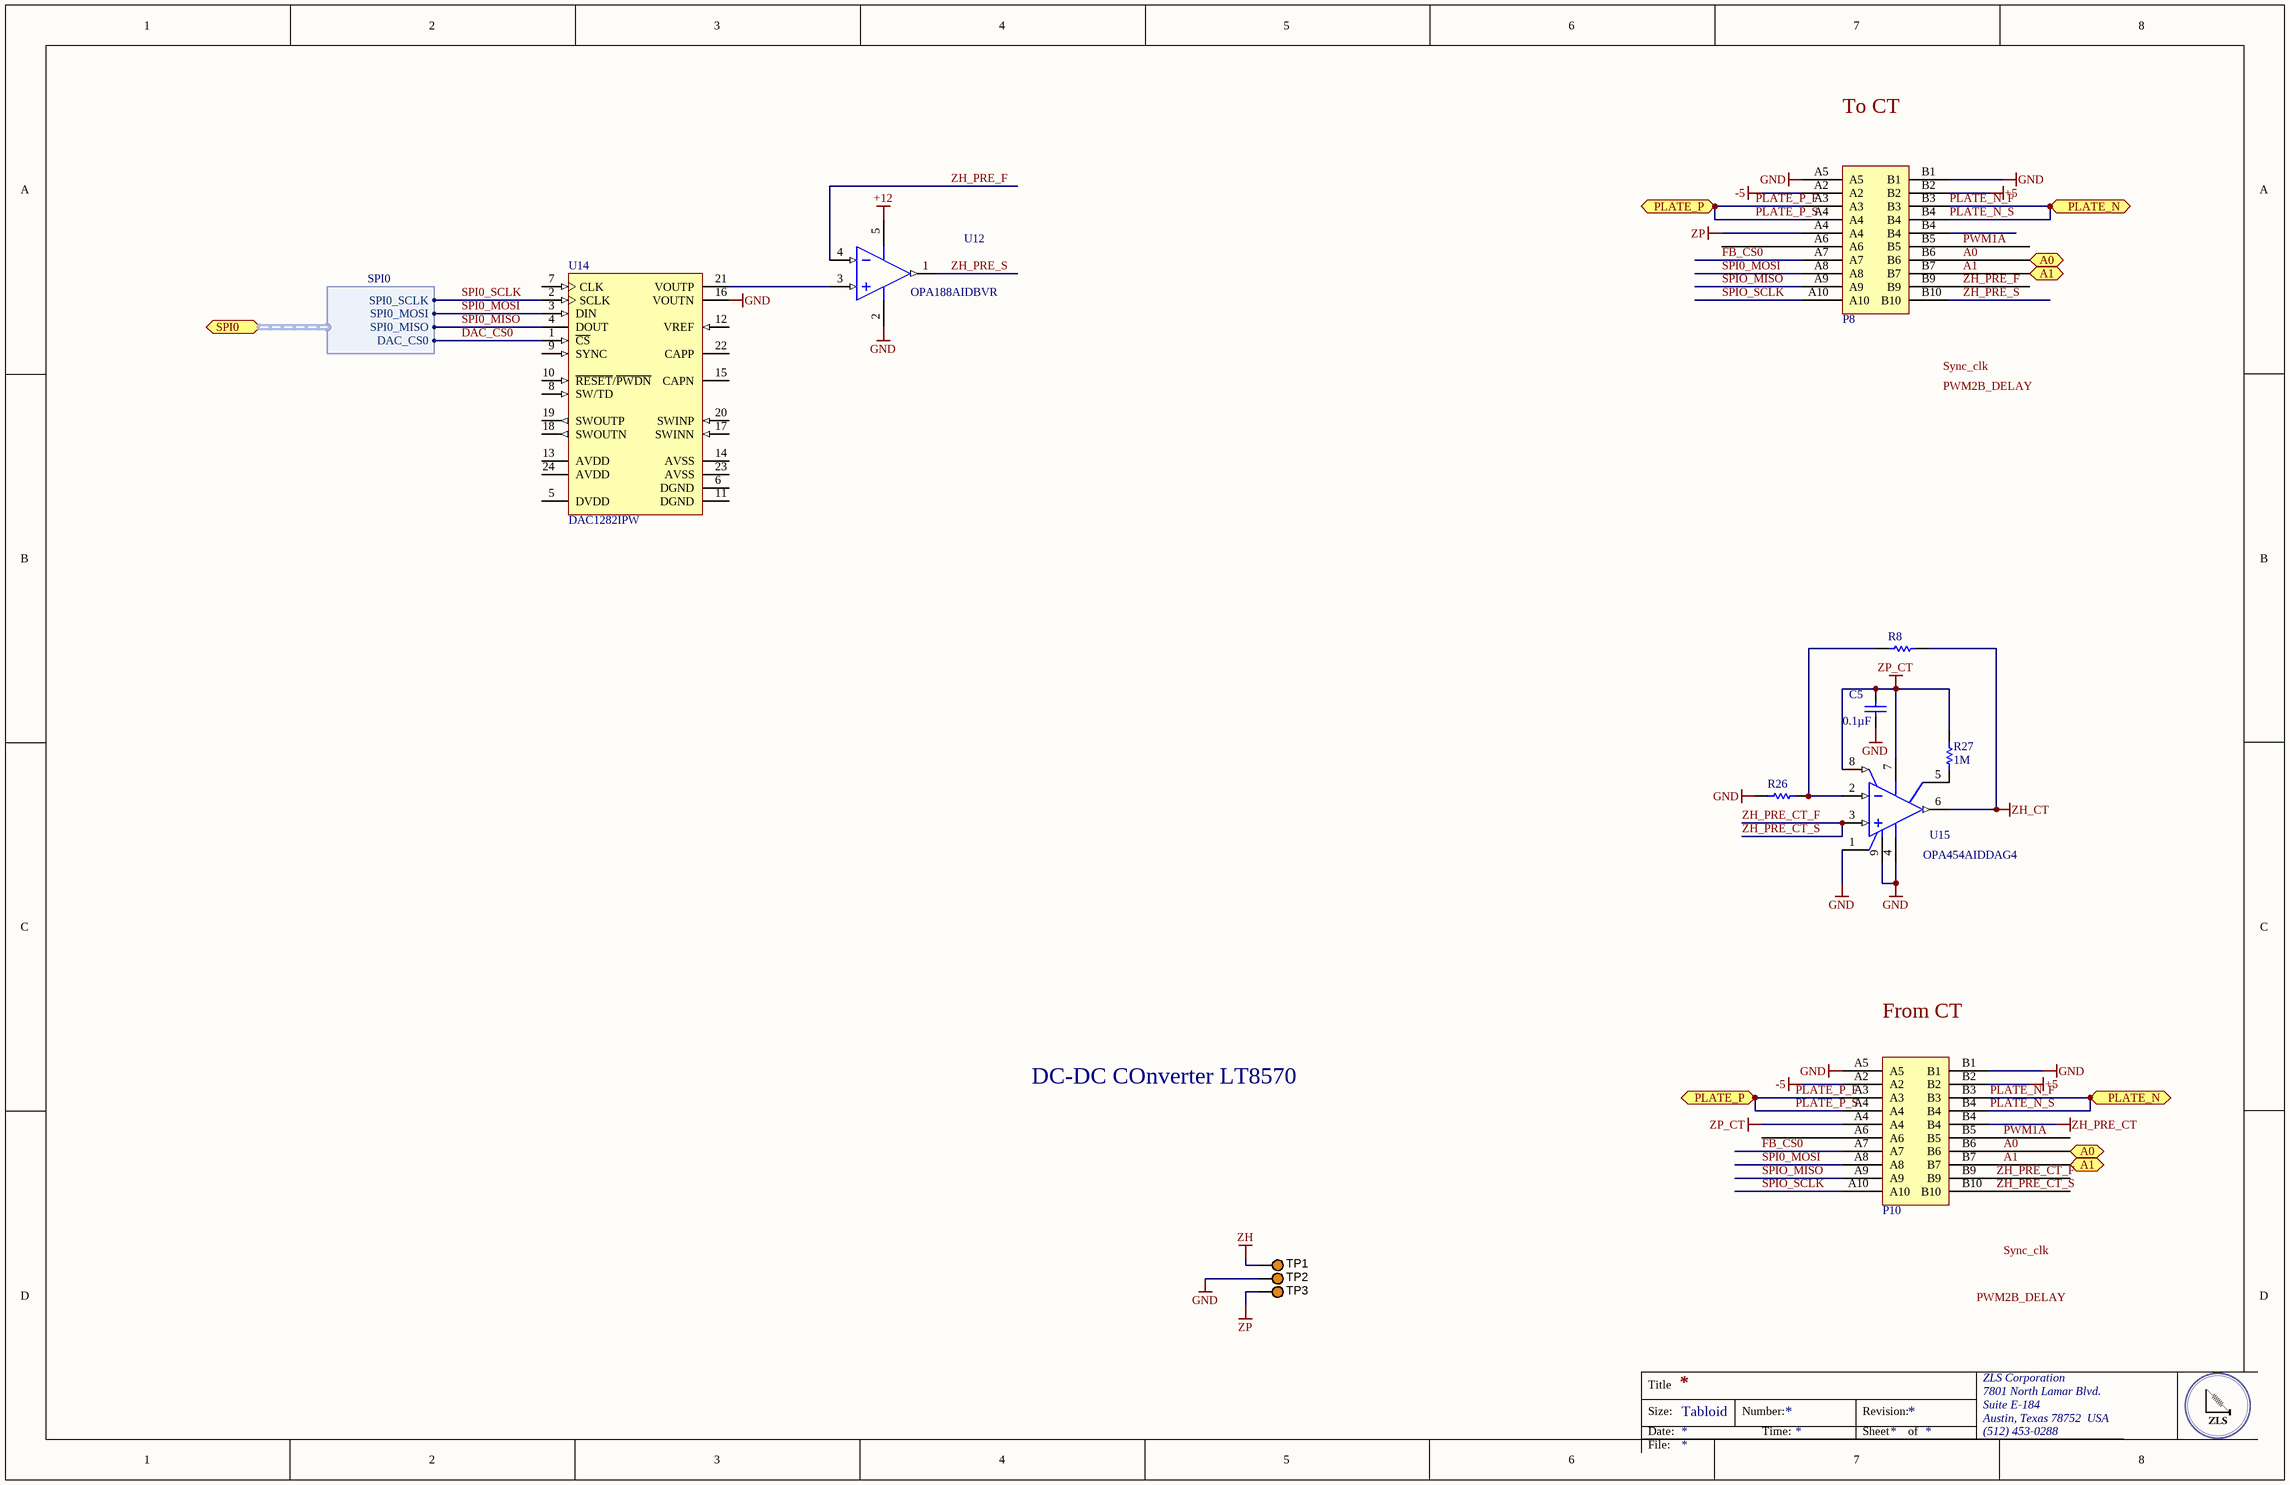
[diagram p4: ZH.SchDoc]

### Parts
C5  Capacitance: 0.1µF  [CAPC0805(2012)145_N]  (hidden comment: CAP CER 0.1UF 25V X7R 0805)
P8  MEC6-110-0-PCB  [MEC6-110-02-L-DV]  (value not drawn)
P10  MEC6-110-0-PCB  [MEC6-110-02-L-DV]  (value not drawn)
R8  (no value)  [RESC0402(1005)_M]
R26  (no value)  [RESC0402(1005)_M]
R27  1M  [RESC0402(1005)_M]
TP1  5003  [KSTN-5003]  (value not drawn)
TP2  5003  [KSTN-5003]  (value not drawn)
TP3  5003  [KSTN-5003]  (value not drawn)
U12  OPA188AIDBVR  [DBV0005A_M]
U14  DAC1282IPW  [TI-PW24_M]
U15  OPA454AIDDAG4  [TI-DDA8-2745X2245TP_N]

### Ports
A0, A1, PLATE_N, PLATE_P, SPI0 (harness SPI0)

### Harnesses
SPI0: DAC_CS0, SPI0_MOSI, SPI0_MISO, SPI0_SCLK

### Nets
+5: P8.B2 P10.B2
+12: U12.5(V+)
-5: P8.A2 P10.A2
GND: C5.2 P8.A5 P8.B1 P10.A5 P10.B1 R26.2 TP2.1 U12.2(V-) U14.16(VOUTN) U15.1(E/D_COM) U15.4(V-) U15.9(EP)
ZH: TP1.1
ZH_CT: R8.1 U15.6(OUT)
ZH_PRE_CT: P10.B4
ZP: P8.A4 TP3.1
ZP_CT: C5.1 P10.A4 R27.2 U15.7(V+) U15.8(E/D)
A0: P8.B6 P10.B6 ; port A0
A1: P8.B7 P10.B7 ; port A1
DAC_CS0: U14.1(~{CS}) ; port SPI0.DAC_CS0
FB_CS0: P8.A7 P10.A7
PLATE_N_F: P8.B3 P8.B4 P10.B3 P10.B4 ; port PLATE_N  [also labelled PLATE_N_S]
PLATE_P_F: P8.A3 P8.A4 P10.A3 P10.A4 ; port PLATE_P  [also labelled PLATE_P_S]
PWM1A: P8.B5 P10.B5
SPI0_MISO: U14.4(DOUT) ; port SPI0.SPI0_MISO
SPI0_MOSI: P8.A8 P10.A8 U14.3(DIN) ; port SPI0.SPI0_MOSI
SPI0_SCLK: U14.2(SCLK) ; port SPI0.SPI0_SCLK
SPIO_MISO: P8.A9 P10.A9
SPIO_SCLK: P8.A10 P10.A10
ZH_PRE_CT_F: P10.B9 P10.B10 U15.3(IN+)  [also labelled ZH_PRE_CT_S]
ZH_PRE_F: P8.B9 U12.4(IN-)
ZH_PRE_S: P8.B10 U12.1(OUT)
NetR8_2: R8.2 R26.1 U15.2(IN-)
NetR27_1: R27.1 U15.5(STATUS_FLAG)
NetU12_3: U12.3(IN+) U14.21(VOUTP)

Not connected (* = marked no-connect by the designer): P8 A6; P10 A6; U14 5(DVDD) 6(DGND) 7(CLK) 8(SW/TD) 9(SYNC) 10(~{RESET}/~{PWDN}) 11(DGND) 12(VREF) 13(AVDD) 14(AVSS) 15(CAPN) 17(SWINN) 18(SWOUTN) 19(SWOUTP) 20(SWINP) 22(CAPP) 23(AVSS) 24(AVDD)

### Notes on the sheet
- To CT
- (near P10) From CT
- DC-DC COnverter LT8570
- Labels drawn without touching a wire or pin: PWM2B_DELAY, Sync_clk
- Title
- Size:
- Date:
- Tabloid
- Number:
- Time:
- Revision:
- Sheet
- of
- ZLS Corporation
- 7801 North Lamar Blvd.
- Suite E-184
- Austin, Texas 78752  USA
- (512) 453-0288
- File:

### Library data of the parts
C5 = CMP-1036-04795-1: as C1 on sheet synch_demod; Supplier 1: Digi-Key; Supplier Part Number 1: 490-1673-6-ND; RoHS: RoHS Compliant; Category: Capacitors; Stock 1: 891652; Pricing 1: 1=0.2, 10=0.145, 100=0.0683, 500=0.04788, 1000=0.03964 (USD); Packaging: Digi-Reel®; Part Status: Active; Voltage - Rated: 25V; Temperature Coefficient: X7R; Operating Temperature: -55°C ~ 125°C; Features: -; Ratings: -; Applications: General Purpose; Mounting Type: Surface Mount, MLCC; Package / Case: 0805 (2012 Metric); Size / Dimension: 0.079" L x 0.049" W (2.00mm x 1.25mm); Height - Seated (Max): -; Thickness (Max): 0.053" (1.35mm); Lead Spacing: -; Lead Style: -; ComponentLink1URL: http://www.murata.com/~/media/webrenewal/support/library/catalog/products/capacitor/mlcc/c02e.ashx; ComponentLink1Description: http://www.murata.com/~/media/webrenewal/support/library/catalog/products/capacitor/mlcc/c02e.ashx
R8 R26 R27 = CMP-1011-00463-1
TP1-TP3 = CMP-1672-00009-1: as TP9 on sheet synch_demod; Max Operating Temperature: 150 degC; PackageReference: 5003; Pins: 2; ComponentLink2URL: http://keyelco.com/userAssets/file/M65p56.pdf; PackageDescription: 1-Pin Through Hole Device, Dia 2.54 mm; Weight: 0.01 lb; Diameter: 5.3 mm; Mount: Through Hole; Package Quantity: 500; Packaging: Bulk; Min Operating Temperature: -65 degC; ComponentLink1Description: Manufacturer URL; Height: 0.25 inch; ComponentLink1URL: http://www.keyelco.com/; ComponentLink2Description: Datasheet; Width: 0.25 inch; REACH SVHC: No SVHC; RoHSCompliant: true; Radiation Hardening: No; Length: 9.5 mm; DatasheetVersion: Jun-15
U12 = CMP-0809-00005-2: as U2 on sheet synch_demod; PartNumber: OPA188AIDBVR; ComponentLink2Description: Datasheet; ComponentLink2URL: http://www.ti.com/lit/ds/symlink/opa188.pdf; ComponentLink1Description: Manufacturer URL; Mounting Technology: Surface Mount; Eco-Plan: Green (RoHS & no Sb/Br); ComponentLink1URL: http://www.ti.com/; PackageVersion: 4073253-4/K, 03/2006; DatasheetVersion: SBOS642A; ComponentLink3Description: Package Specification; PackageReference: DBV0005A; ComponentLink3URL: http://www.ti.com/litv/pdf/mpds018i; PackageDescription: 5-Pin Plastic Small Outline, Body 1.6 x 2.9 mm, Pitch 0.95 mm; Code_JEDEC: MO-178
U14 = CMP-0004-01365-1: Low Distortion DAC for Seismic Application, -40 to 85 degC, 24-pin SOP (PW24), Green (RoHS & no Sb/Br); Manufacturer: Texas Instruments; Settling Time(us): 25; SubFamily: Precision DAC (=<10MSPS); DAC Channels: 1; Interface: Serial SPI; Power Consumption(Typ)(mW): 38; SNR(dB): 120; Code_JEDEC: MO-153; PackageDescription: 24-Pin Plastic Small Outline, Body 7.8 x 4.4 mm, Pitch 0.65 mm; ComponentLink3URL: http://www.ti.com/litv/pdf/mpds363; ComponentLink2Description: Datasheet; PackageVersion: 4040064-6/G, 02/2011; PartNumber: DAC1282IPW; PackageReference: PW24; ComponentLink2URL: http://www.ti.com/general/docs/lit/getliterature.tsp?genericPartNumber=DAC1282&fileType=pdf; ComponentLink3Description: Package Specification; DatasheetVersion: SBAS490A; Mounting Technology: Surface Mount; ComponentLink1Description: Manufacturer URL; Eco-Plan: Green (RoHS & no Sb/Br); ComponentLink1URL: http://www.ti.com/
U15 = CMP-0017-00715-1: High Voltage (100V), High-Current (50mA) Operational Amplifier, G=1 Stable, 10 to 100 V, -55 to 125 degC, 8-pin SOP (DDA8), Green (RoHS & no Sb/Br); Manufacturer: Texas Instruments; Sub Family: General Purpose Amplifier, High Output Current Amplifier (>=50mA), High Supply Voltage Amplifier (>=30V), Precision Amplifier; Offset Drift(Typ)(uV/C): 1.6; Slew Rate(Typ)(V/us): 13; Number of Channels: 1; Total Supply Voltage(Max)(+5V is 5, +/-5V is 10): 100; Total Supply Voltage(Min)(+5V is 5, +/-5V is 10): 10; Vio (25C)(Max)(mV): 4; GBW(Typ)(MHz): 2.5; Vn at 1kHz(Typ)(nV/rtHz): 47; Rating: Catalog; ComponentLink1URL: http://www.ti.com/; PartNumber: OPA454AIDDAG4; ComponentLink1Description: Manufacturer URL; Eco-Plan: Green (RoHS & no Sb/Br); ComponentLink3URL: http://www.ti.com/litv/pdf/mpds092e; IIB(Max)(pA): 100; ComponentLink2URL: http://www.ti.com/lit/ds/symlink/opa454.pdf; ComponentLink3Description: Package Specification; DatasheetVersion: SBOS391A; Iq per channel(Max)(mA): 4; PackageVersion: 4202561/F, 12/2011; Code_JEDEC: MS-012; CMRR(Min)(dB): 100; PackageReference: DDA8-2745X2245TP; Mounting Technology: Surface Mount; ComponentLink2Description: Datasheet; PackageDescription: 8-Pin PowerPAD(TM) Plastic Small Outline, Body 3.9 x 4.9 mm, Pitch 1.27 mm

## Sheet ZP.SchDoc
size OrCAD A
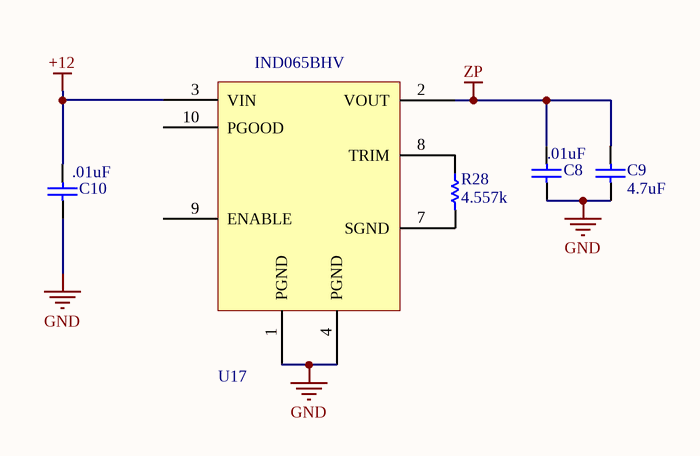
[diagram p5: ZP.SchDoc]

### Parts
C8  .01uF  [CAPC0805(2012)145_N]
C9  4.7uF  [CAPC1210(3225)170_N]
C10  .01uF  [CAPC0805(2012)145_N]
R28  4.557k  [RESC0805(2012)_L]
U17  IND065BHV  [IND065BHV]

### Nets
+12: C10.2 U17.3(VIN)
GND: C8.1 C9.1 C10.1 U17.1(PGND) U17.4(PGND)
ZP: C8.2 C9.2 U17.2(VOUT)
NetR28_1: R28.1 U17.8(TRIM)
NetR28_2: R28.2 U17.7(SGND)

Not connected (* = marked no-connect by the designer): U17 9(ENABLE) 10(PGOOD)

### Library data of the parts
C8 C10 = CMP-1036-04795-1: CAP CER 0.1UF 25V X7R 0805
C9 = CMP-1038-00473-1: CAP 4.7uF 100V ±2% 1210 (3225 Metric) Thickness 1.7mm SMD; Value: 680pF; Case-EIA: 1210; Case-Metric: 3225; Tolerance: Â±2%; Rated Voltage: 100 V; Max Thickness: 1.7 mm; Technology: SMT
R28 = CMP-1013-00215-1: RES SMD 56.2K OHM JUMPER 1/8W 0805

## Nets that join several sheets
+3.3: synch_demod (P3.6 P4.25), ADC (U9.19), BBB (U5.9-15)
+5: synch_demod (P1.4 P3.2 P4.22), ADC (7 pins), Beam_Amp (P6.B2), ZH (P8.B2 P10.B2)
+5 BBB: synch_demod (P4.1), BBB (U5.9-5 U5.9-6)
+5R: synch_demod (U4.12 U4.17 U7.1 U7.4), ADC (R24.2)
+12: synch_demod (12 pins), ZH (U12.5), ZP (C10.2 U17.3)
-5: synch_demod (5 pins), Beam_Amp (P6.A2 U11.5), ZH (P8.A2 P10.A2)
GND: synch_demod (29 pins), ADC (12 pins), BBB (8 pins), Beam_Amp (10 pins), ZH (12 pins), ZP (5 pins)
ZH: synch_demod (P1.10), ADC (R20.2), Beam_Amp (P6.B4), ZH (TP1.1)
ZH_CT: Beam_Amp (U11.12 U11.17), ZH (R8.1 U15.6)
ZP: synch_demod (P1.9 P4.18), ADC (R22.2), Beam_Amp (P6.A4), ZH (P8.A4 TP3.1), ZP (C8.2 C9.2 U17.2)
ZP_CT: Beam_Amp (U11.16), ZH (5 pins)
A0: synch_demod (P1.14), Beam_Amp (P6.B6), ZH (P8.B6 P10.B6)
A1: synch_demod (P1.16), Beam_Amp (P6.B7), ZH (P8.B7 P10.B7)
BBB_PWR_SW: synch_demod (P4.3), BBB (U5.9-9)
FB_CS0: synch_demod (P4.6), ADC (U9.10), Beam_Amp (P6.A7)
FB_MUX_A0: synch_demod (P3.27), BBB (U5.8-25)
NetP3_13: synch_demod (P3.13), BBB (U5.8-22)
PLATE_N_F: Beam_Amp (P2.2 P6.B3 P6.B4), ZH (P8.B3 P8.B4 P10.B3 P10.B4)
PLATE_P_F: Beam_Amp (P2.1 P6.A3 P6.A4), ZH (P8.A3 P8.A4 P10.A3 P10.A4)
PWM1A: BBB (U5.9-14), Beam_Amp (R7.2 U11.11 U11.20)
PWM2A: synch_demod (P3.17), BBB (U5.8-19)
PWM2B: synch_demod (P3.21 U4.11 U4.20), BBB (U5.8-13)
SPI0_MISO: synch_demod (P4.11), ADC (U9.12), Beam_Amp (P6.A9), ZH (U14.4)
SPI0_MOSI: synch_demod (P1.15 P4.9), ADC (U9.13), Beam_Amp (P6.A8), ZH (P8.A8 P10.A8 U14.3)
SPI0_SCLK: synch_demod (P4.13), ADC (U9.11), Beam_Amp (P6.A10), ZH (U14.2)